# Altium schematic sheet variateur.SchDoc
size A4
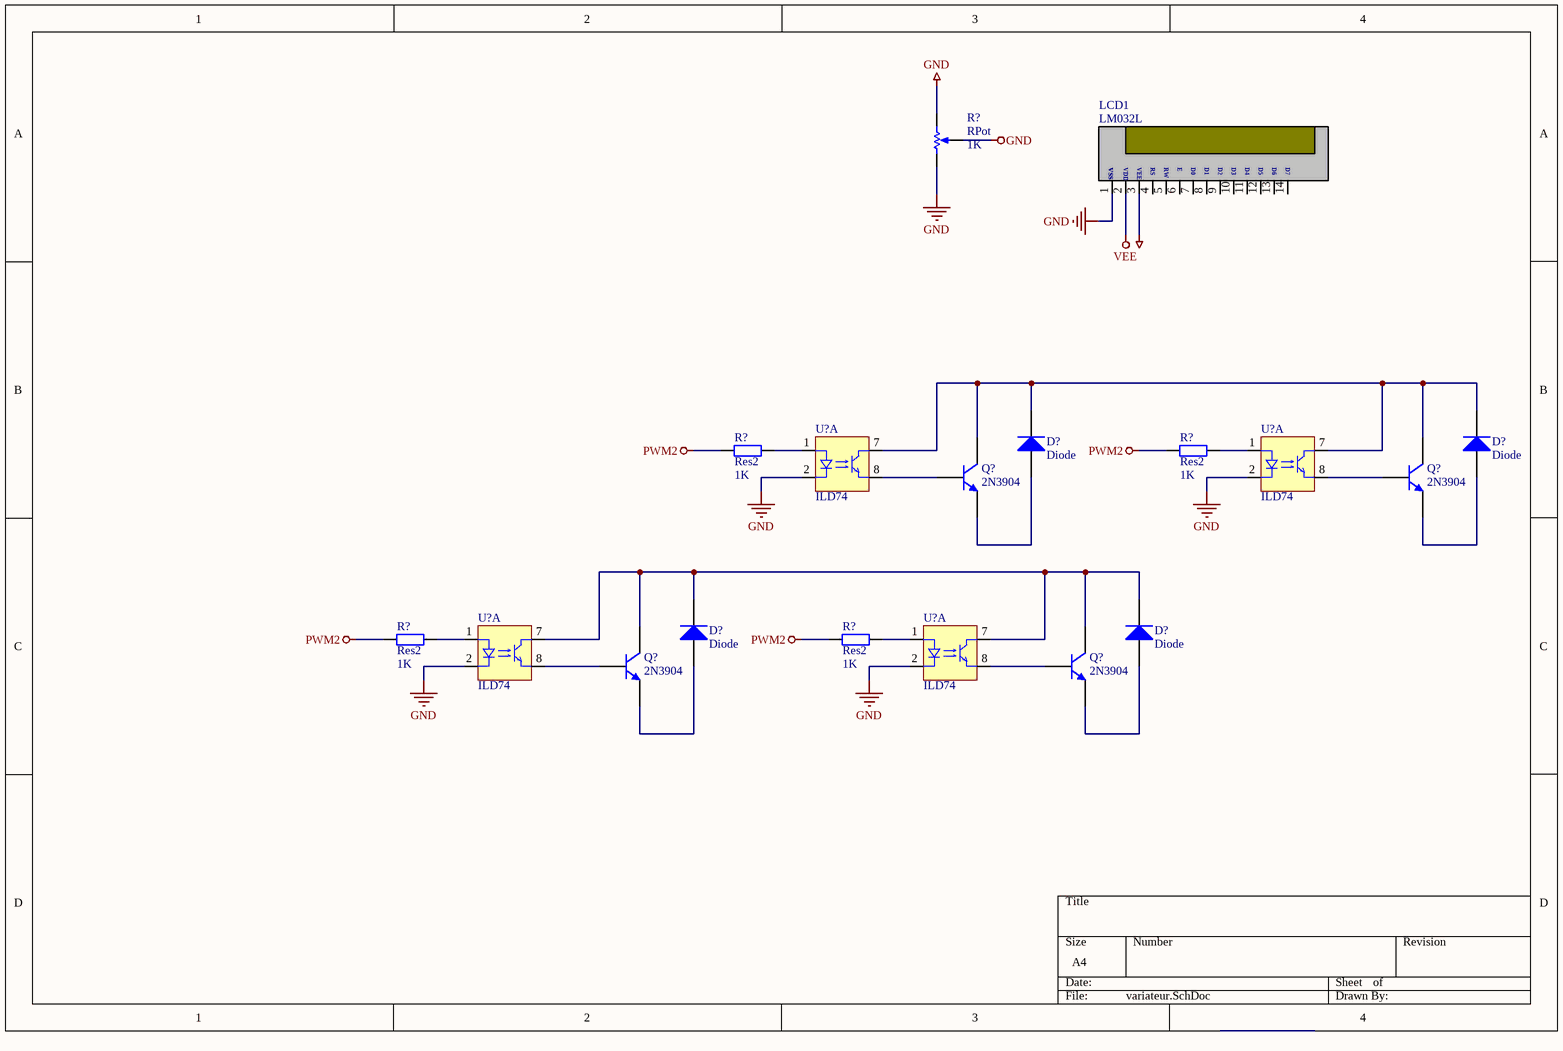
[diagram p0: variateur.SchDoc]

## Parts
(Parts that share a designator on the sheet are numbered #1, #2 ... from top to bottom, then left to right.)
D?#1  Diode  [SMC]
D?#2  Diode  [SMC]
D?#3  Diode  [SMC]
D?#4  Diode  [SMC]
LCD1  LM032L
Q?#1  2N3904  [TO-92A]
Q?#2  2N3904  [TO-92A]
Q?#3  2N3904  [TO-92A]
Q?#4  2N3904  [TO-92A]
R?#1  RPot  value 1K  [VR5]
R?#2  Res2  value 1K  [AXIAL-0.4]
R?#3  Res2  value 1K  [AXIAL-0.4]
R?#4  Res2  value 1K  [AXIAL-0.4]
R?#5  Res2  value 1K  [AXIAL-0.4]
U?#1  ILD74  [DIP8]  (part A of 2)
U?#2  ILD74  [DIP8]  (part A of 2)
U?#3  ILD74  [DIP8]  (part A of 2)
U?#4  ILD74  [DIP8]  (part A of 2)

## Nets
GND: R?#1.1(TOP) R?#1.2(BOT) R?#1.3(TAP) U?#1.2(K) U?#2.2(K) U?#3.2(K) U?#4.2(K)
PWM2: R?#2.1 R?#3.1 R?#4.1 R?#5.1
NetD?#1_1: D?#1.1(A) Q?#1.1(E)
NetD?#1_2: D?#1.2(K) D?#2.2(K) Q?#1.3(C) Q?#2.3(C) U?#1.7(C) U?#2.7(C)
NetD?#2_1: D?#2.1(A) Q?#2.1(E)
NetD?#3_1: D?#3.1(A) Q?#3.1(E)
NetD?#3_2: D?#3.2(K) D?#4.2(K) Q?#3.3(C) Q?#4.3(C) U?#3.7(C) U?#4.7(C)
NetD?#4_1: D?#4.1(A) Q?#4.1(E)
NetQ?#1_2: Q?#1.2(B) U?#1.8(E)
NetQ?#2_2: Q?#2.2(B) U?#2.8(E)
NetQ?#3_2: Q?#3.2(B) U?#3.8(E)
NetQ?#4_2: Q?#4.2(B) U?#4.8(E)
NetR?#2_2: R?#2.2 U?#1.1(A)
NetR?#3_2: R?#3.2 U?#2.1(A)
NetR?#4_2: R?#4.2 U?#3.1(A)
NetR?#5_2: R?#5.2 U?#4.1(A)

## Notes on the sheet
- (in symbol Component_1) vss; VDD; VEE; RS; RW; E; D0; D1; D2; D3; D4; D5; D6; D7; 1; 2; 3; 4; 5; 6; 7; 8; 9; 10; 11; 12; 13; 14

## Library data of the parts
D?#1-D?#4 = Diode: Default Diode; Published: 8-Jun-2000; LatestRevisionDate: 17-Jul-2002; LatestRevisionNote: Re-released for DXP Platform.; PackageVersion: Sep-1996; PackageReference: SMC; Publisher: Altium Limited; PackageDescription: DO-214-AB/SMC; 2 C-Bend Leads; Body 7.9 x 5.9 mm, inc. leads (LxW); Code_JEDEC: DO-214-AB
LCD1 = Component_1
Q?#1-Q?#4 = 2N3904: NPN General Purpose Amplifier; Published: 8-Jun-2000; LatestRevisionDate: 15-Jan-2003; LatestRevisionNote: PCB Footprint 'BCY-W3/D4.7' replaced; DatasheetVersion: 1997; PackageVersion: Sep-1998; PackageReference: TO-92A; Publisher: Altium Limited; PackageDescription: TO, Flat Index; 3 In-Line, Axial Leads; Body Dia. 4.5mm; Leads 0.51 x 0.48 mm (max); ComponentLink1Description: Manufacturer Link; ComponentLink1URL: http://www.fairchildsemi.com/; ComponentLink2Description: Datasheet; ComponentLink2URL: http://www.fairchildsemi.com/ds/2N%2F2N3904.pdf
R?#1 = RPot: Potentiometer; Sim Note: Enter the Resistance value and the set point into parameter fields.; Set Position: 0.5; Published: 8-Jun-2000; LatestRevisionDate: 17-Jul-2002; LatestRevisionNote: Re-released for DXP Platform.; PackageReference: VR5; Publisher: Altium Limited; PackageDescription: Variable Resistor, Thru-Hole; 3 Leads
R?#2-R?#5 = Res2: Resistor; Published: 8-Jun-2000; LatestRevisionDate: 17-Jul-2002; LatestRevisionNote: Re-released for DXP Platform.; PackageReference: AXIAL-0.4; Publisher: Altium Limited; PackageDescription: Axial Device, Thru-Hole; 2 Leads; 0.4 in Pin Spacing
U?#1-U?#4 = ILD74: Optocoupler, Phototransistor Output, Dual Channel, TTL Compatible, Pb-free; Note: Coupling Capacitance, 0.5 pF; Note: Transfer Ratio, 35 % Typical; Published: 6-Oct-2005; DatasheetDocument: Rev. 1.4, Oct-2004; PackageDocument: Dec-2003; PackageReference: DIP8; Publisher: Altium Limited; ComponentLink1Description: Manufacturer Link; ComponentLink1URL: http://www.vishay.com/optocouplers/list/product-83640/; ComponentLink2Description: Datasheet; ComponentLink2URL: http://www.vishay.com/docs/83640/83640.pdf